# EAGLE schematic atmosphere2n (EAGLE 7.5.0)
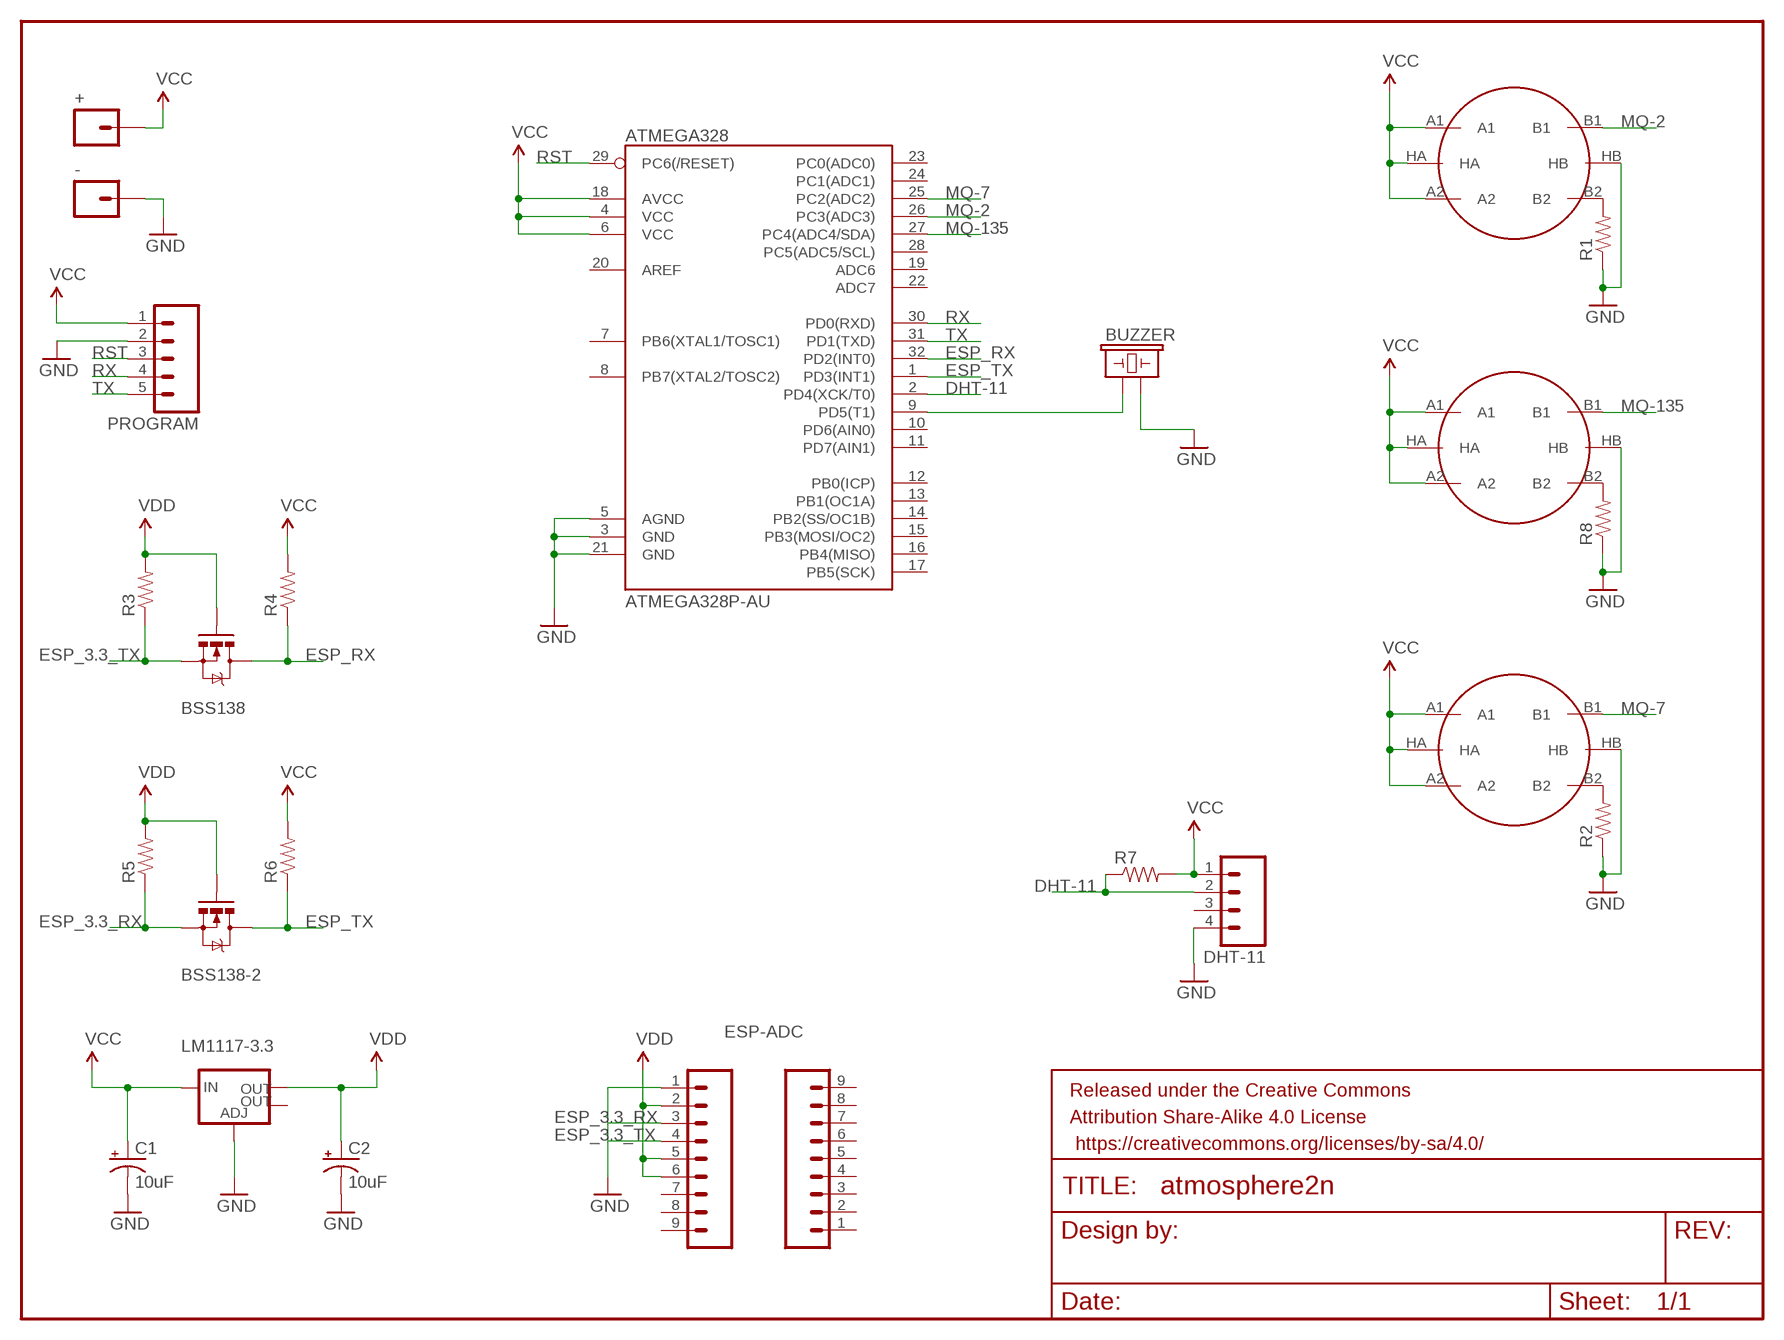
[diagram p0: schematic, sheet 1]

## Parts
+  M01SMD  [LUXEON-PAD]
-  M01SMD  [LUXEON-PAD]
ATMEGA328P-AU  ATMEGA328  [TQFP32-08]
BSS138  MOSFET-NCHANNELBSS138  [SOT23-3]
BSS138-2  MOSFET-NCHANNELBSS138  [SOT23-3]
BUZZER  BUZZERNS  [BUZZER-12MM-NS]
C1  10uF  10UF-16V-10%(TANT)  [EIA3216]
C2  10uF  10UF-16V-10%(TANT)  [EIA3216]
DHT-11  M04NO_SILK_ALL_ROUND  [1X04_NO_SILK_ALL_ROUND]
ESP-ADC  M09NO_SILK  [1X09_NO_SILK]
FRAME1  FRAME-LETTER  [CREATIVE_COMMONS]
J5  M09NO_SILK  [1X09_NO_SILK]
LM1117-3.3  V_REG_LM1117SOT223  [SOT223]
PROGRAM  M05NO_SILK  [1X05_NO_SILK]
R1  RESISTOR0805-RES  [0805]
R2  RESISTOR0805-RES  [0805]
R3  RESISTOR0805-RES  [0805]
R4  RESISTOR0805-RES  [0805]
R5  RESISTOR0805-RES  [0805]
R6  RESISTOR0805-RES  [0805]
R7  RESISTOR0805-RES  [0805]
R8  RESISTOR0805-RES  [0805]
U$1  METHANE_SENSOR  [MQ-3]
U$2  METHANE_SENSOR  [MQ-3]
U$3  METHANE_SENSOR  [MQ-3]

## Nets
DHT-11: ATMEGA328P-AU.2(PD4(XCK/T0)) DHT-11.2 R7.1
ESP_3.3_RX: BSS138-2.2(S) ESP-ADC.3 R5.1
ESP_3.3_TX: BSS138.2(S) ESP-ADC.4 R3.1
ESP_RX: ATMEGA328P-AU.32(PD2(INT0)) BSS138.3(D) R4.1
ESP_TX: ATMEGA328P-AU.1(PD3(INT1)) BSS138-2.3(D) R6.1
GND: -.P$1 ATMEGA328P-AU.3(GND) ATMEGA328P-AU.5(AGND) ATMEGA328P-AU.21(GND) BUZZER.- C1.C(-) C2.C(-) DHT-11.4 ESP-ADC.1 LM1117-3.3.1(ADJ) PROGRAM.2 R1.1 R2.1 R8.1 U$1.HB U$2.HB U$3.HB
MQ-2: ATMEGA328P-AU.26(PC3(ADC3)) U$1.B1
MQ-7: ATMEGA328P-AU.25(PC2(ADC2)) U$3.B1
MQ-135: ATMEGA328P-AU.27(PC4(ADC4/SDA)) U$2.B1
N$1: R2.2 U$3.B2
N$2: R8.2 U$2.B2
N$3: R1.2 U$1.B2
N$19: ATMEGA328P-AU.9(PD5(T1)) BUZZER.+
RST: ATMEGA328P-AU.29(PC6(/RESET)) PROGRAM.3
RX: ATMEGA328P-AU.30(PD0(RXD)) PROGRAM.4
TX: ATMEGA328P-AU.31(PD1(TXD)) PROGRAM.5
VCC: +.P$1 ATMEGA328P-AU.4(VCC) ATMEGA328P-AU.6(VCC) ATMEGA328P-AU.18(AVCC) C1.A(+) DHT-11.1 LM1117-3.3.3(IN) PROGRAM.1 R4.2 R6.2 R7.2 U$1.A1 U$1.A2 U$1.HA U$2.A1 U$2.A2 U$2.HA U$3.A1 U$3.A2 U$3.HA
VDD: BSS138-2.1(G) BSS138.1(G) C2.A(+) ESP-ADC.2 ESP-ADC.5 ESP-ADC.6 LM1117-3.3.2(OUT) R3.2 R5.2
Unconnected: ATMEGA328P-AU.7(PB6(XTAL1/TOSC1)) ATMEGA328P-AU.8(PB7(XTAL2/TOSC2)) ATMEGA328P-AU.10(PD6(AIN0)) ATMEGA328P-AU.11(PD7(AIN1)) ATMEGA328P-AU.12(PB0(ICP)) ATMEGA328P-AU.13(PB1(OC1A)) ATMEGA328P-AU.14(PB2(SS/OC1B)) ATMEGA328P-AU.15(PB3(MOSI/OC2)) ATMEGA328P-AU.16(PB4(MISO)) ATMEGA328P-AU.17(PB5(SCK)) ATMEGA328P-AU.19(ADC6) ATMEGA328P-AU.20(AREF) ATMEGA328P-AU.22(ADC7) ATMEGA328P-AU.23(PC0(ADC0)) ATMEGA328P-AU.24(PC1(ADC1)) ATMEGA328P-AU.28(PC5(ADC5/SCL)) DHT-11.3 ESP-ADC.7 ESP-ADC.8 ESP-ADC.9 J5.1 J5.2 J5.3 J5.4 J5.5 J5.6 J5.7 J5.8 J5.9 LM1117-3.3.4(OUT)

## Library data of the parts
+ - = SparkFun-Connectors:M01: Header 1 Standard 1-pin 0.1" header. Use with straight break away headers (SKU : PRT-00116), right angle break away headers (PRT-00553), swiss pins (PRT-00743), machine pins (PRT-00117), and female headers (PRT-00115). SMTSO-256-ET is a "flush mount" nut for a 4-40 screw. The older package used to be too tight, and did not allow it to sit properly thru the drill hit. The latest (0.165DIA) fits nice and snug.
ATMEGA328P-AU = thecustomgeek:ATMEGA328: ATmega328P-AU TQFP 32 pin
BSS138 BSS138-2 = SparkFun-DiscreteSemi:MOSFET-NCHANNEL: Common NMOSFET Parts MFG P/N Store ID Prod ID FDD8780 TRANS-09984 SI7820DN TRANS-11055 FDS6630A IC-08089 2N7002PW TRANS-11151 FQP30N06L COM-10213 TRANS-10060 BSS123LT1G TRANS-08345 BSS138 TRANS-00830 BS170 2N7000; PROD_ID: TRANS-00830; VALUE: 200mA/50V
BUZZER = SparkFun-Electromechanical:BUZZER: Buzzer 12mm Spark Fun Electronics SKU : Comp-Buzzer
C1 C2 = SparkFun-Capacitors:10UF-16V-10%(TANT): CAP-00811 1206/EIA-3216 Tantalum capacitor; PROD_ID: CAP-00811
DHT-11 = SparkFun-Connectors:M04: Header 4 Standard 4-pin 0.1" header. Use with straight break away headers (SKU : PRT-00116), right angle break away headers (PRT-00553), swiss pins (PRT-00743), machine pins (PRT-00117), and female headers (PRT-00115). Molex polarized connector foot print use with SKU : PRT-08231 with associated crimp pins and housings. 1MM SMD Version SKU: PRT-10208; PROD_ID: CONN-09696
ESP-ADC J5 = SparkFun-Connectors:M09: Header 9 Standard 9-pin 0.1" header. Use with straight break away headers (SKU : PRT-00116), right angle break away headers (PRT-00553), swiss pins (PRT-00743), machine pins (PRT-00117), and female headers (PRT-00115).
FRAME1 = SparkFun-Aesthetics:FRAME-LETTER: Schematic Frame Standard 8.5x11 US Letter frame
LM1117-3.3 = SparkFun-PowerIC:V_REG_LM1117: Voltage Regulator LM1117 Standard adjustable voltage regulator but in SMD form. Spark Fun Electronics SKU : COM-00595; PROD_ID: VREG-08170
PROGRAM = SparkFun-Connectors:M05: Header 5 Standard 5-pin 0.1" header. Use with straight break away headers (SKU : PRT-00116), right angle break away headers (PRT-00553), swiss pins (PRT-00743), machine pins (PRT-00117), and female headers (PRT-00115). Molex polarized connector foot print use with SKU : PRT-08230 with associated crimp pins and housings.
R1-R8 = SparkFun-Passives:RESISTOR: Resistor Basic schematic elements and footprints for 0603, 1206, and PTH resistors.
U$1-U$3 = SparkFun-Sensors:METHANE_SENSOR: MQ-4 Methane Gas Sensor SEN-09404